# EAGLE design interface-board (EAGLE 6.4)
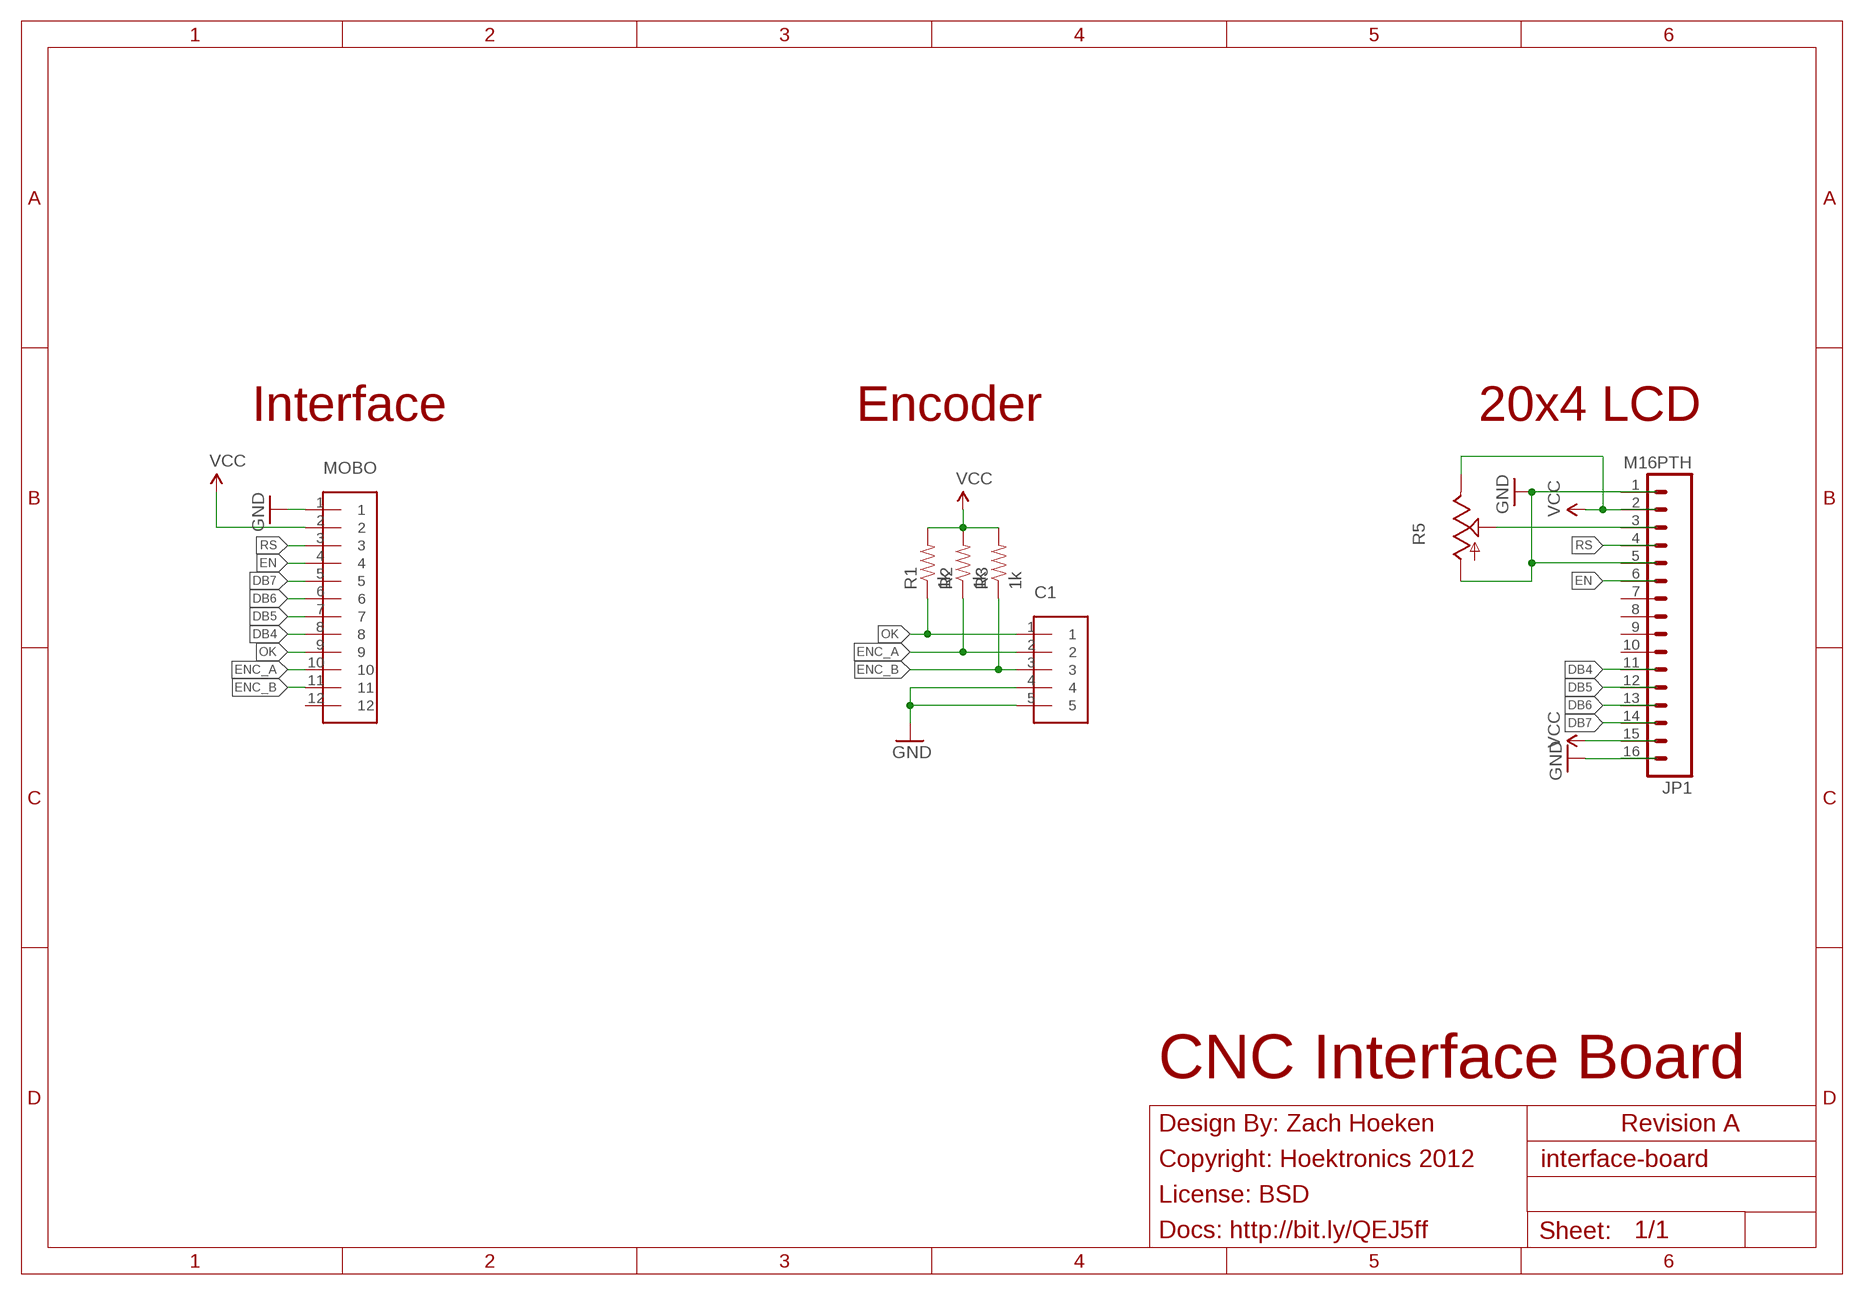
[diagram p0: schematic, sheet 1]

## Parts
C1  CONN-5  [XH-5]
JP1  M16PTH  [1X16]
MOBO  CONN-12  [XH-12]
R1  1k  RESISTOR0805  [0805-RC]
R2  1k  RESISTOR0805  [0805-RC]
R3  1k  RESISTOR0805  [0805-RC]
R5  TRIM_US-B25P  [B25P]

## Nets
DB4: JP1.11 MOBO.8
DB5: JP1.12 MOBO.7
DB6: JP1.13 MOBO.6
DB7: JP1.14 MOBO.5
EN: JP1.6 MOBO.4
ENC_A: C1.2 MOBO.10 R2.1
ENC_B: C1.3 MOBO.11 R3.1
GND: C1.4 C1.5 JP1.1 JP1.5 JP1.16 MOBO.1 R5.A
N$19: JP1.3 R5.S
OK: C1.1 MOBO.9 R1.1
RS: JP1.4 MOBO.3
VCC: JP1.2 JP1.15 MOBO.2 R1.2 R2.2 R3.2 R5.E
Unconnected: JP1.7 JP1.8 JP1.9 JP1.10 MOBO.12

## Notes on the sheet
- Interface | Encoder | 20x4 LCD
- CNC Interface Board
- Design By: Zach Hoeken | Revision A
- Copyright: Hoektronics 2012
- License: BSD
- Docs: http://bit.ly/QEJ5ff

## Library data of the parts
C1 = Hoektronics:CONN-5
JP1 = SparkFun-Connectors:M16: 1x16 .1" header
MOBO = Hoeken:CONN-12
R1-R3 = Hoektronics:RESISTOR: Resistor Basic schematic elements and footprints for 0603, 1206, and PTH 1/10th watt (small) resistors.
R5 = pot:TRIM_US-: POTENTIOMETER

## Net classes
0 default: width 0.381 mm, clearance 0.381 mm

## Board
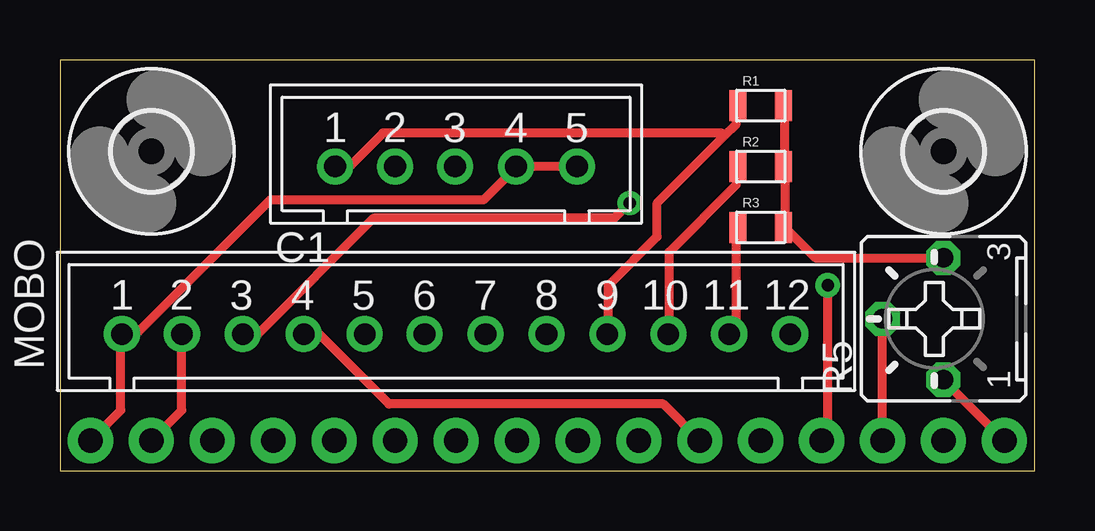
[diagram p1: board, top side]
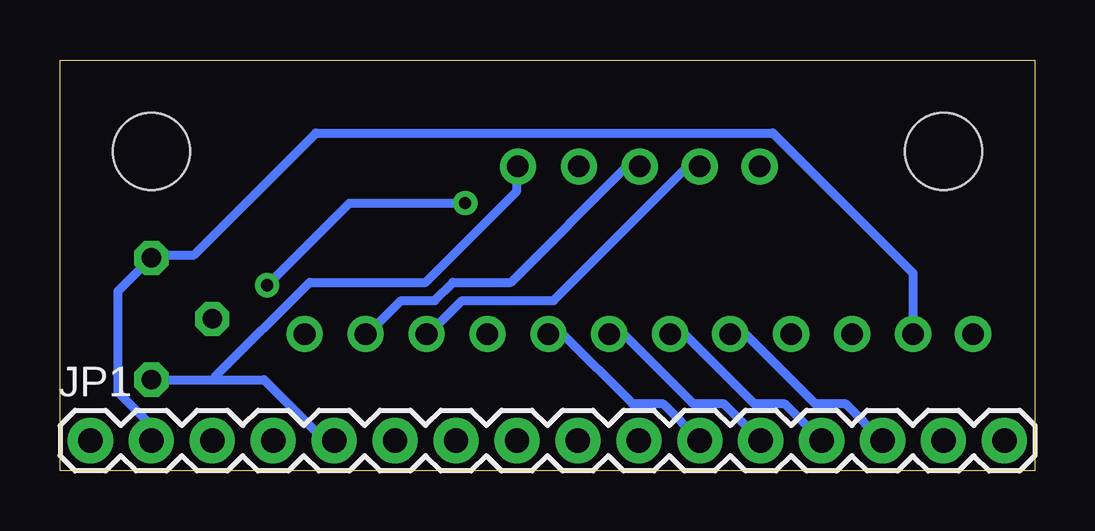
[diagram p2: board, bottom side, seen from below]

Size 40.64 x 17.14 mm. Coordinates in mm from the lower left corner, seen from the top.
Outline: 0,0 40.64,0 40.64,17.14 0,17.14 0,0
Copper layers (1*16): Top 0.035mm / dielectric 1.5mm / Bottom 0.035mm
Design rules "hoektronics": minimum track width 8mil, minimum drill 20mil, track to track 8mil, track to pad 8mil, pad to pad 8mil, via to via 8mil, smd to smd 8mil, copper to edge 10mil, drill to drill 8mil, minimum pad ring 12mil, minimum via ring 10mil, stop-mask expansion 4mil, vias tented up to drill 25mil, thermal gap 10mil

### Footprints (pad centres in the part's own frame; a part is rotated, then mirrored left to right if it is on the bottom)
XH-5 = drill 0.9: 1 -3.77,0; 2 -1.27,0; 3 1.23,0; 4 3.77,0; 5 6.31,0
1X16 = drill 1.016 pad 1.88: 1 0,0; 2 2.54,0; 3 5.08,0; 4 7.62,0; 5 10.16,0; 6 12.7,0; 7 15.24,0; 8 17.78,0; 9 20.32,0; 10 22.86,0; 11 25.4,0; 12 27.94,0; 13 30.48,0; 14 33.02,0; 15 35.56,0; 16 38.1,0
XH-12 = drill 0.9: 1 -6.31,0; 2 -3.81,0; 3 -1.27,0; 4 1.27,0; 5 3.81,0; 6 6.31,0; 7 8.85,0; 8 11.39,0; 9 13.93,0; 10 16.47,0; 11 19.01,0; 12 21.55,0
0805-RC = smd 0.7 x 1.3: 1 -0.95,0; 2 0.95,0
B25P = drill 0.813 octagon: A -2.54,0; E 2.54,0; S 0,2.54
3,2 = hole 3.2: 0,0

### Placement (x,y rotation side)
C1  15.24,12.7 0 top
JP1  39.37,1.27 0 bottom
MOBO  8.89,5.71 0 top
R1  29.21,15.24 0 top
R2  29.21,12.7 0 top
R3  29.21,10.16 0 top
R5  36.83,6.35 90 top
U$1  [3,2]  3.81,13.34 0 top
U$2  [3,2]  36.83,13.34 0 top

### Tracks (layer width: path | path; a pad name or v marks a point on that pad's centre or on a via)
DB4
  Bottom 0.381: MOBO.8 19.68,5.71 16.76,2.79 15.49,2.79 JP1.11
DB5
  Bottom 0.381: MOBO.7 17.14,5.71 14.22,2.79 12.95,2.79 JP1.12
DB6
  Bottom 0.381: MOBO.6 14.61,5.71 11.68,2.79 10.41,2.79 JP1.13
DB7
  Bottom 0.381: MOBO.5 12.06,5.71 9.14,2.79 7.87,2.79 JP1.14
EN
  Top 0.381: MOBO.4 10.79,5.71 13.72,2.79 25.15,2.79 JP1.6
ENC_A
  Top 0.381: R2.1 28.19,12.7 28.19,11.94 25.4,9.14 25.4,5.71 MOBO.10
  Bottom 0.381: C1.2 14.48,12.7 20.07,7.11 23.88,7.11 25.27,5.71 MOBO.10
ENC_B
  Top 0.381: R3.1 28.19,10.16 28.19,5.97 27.94,5.71 MOBO.11
  Bottom 0.381: C1.3 17.02,12.7 21.84,7.87 24.26,7.87 25.02,7.11 26.42,7.11 27.81,5.71 MOBO.11
GND
  Top 0.381: JP1.16 2.54,2.54 2.54,5.71 MOBO.1 2.67,5.84 3.3,5.84 8.76,11.3 17.65,11.3 18.92,12.57 C1.4 C1.5 | JP1.1 R5.A
  Bottom 0.381: JP1.5 29.59,1.27 32.13,3.81 34.16,3.81 | R5.A 34.16,3.81 | C1.5 21.59,12.7 21.59,11.68 25.4,7.87 30.23,7.87 34.16,3.94 34.16,3.81
N$19
  Top 0.381: JP1.3 R5.S
OK
  Top 0.381: 27.69,13.97 24.89,11.18 24.89,9.78 22.86,7.75 22.86,5.71 MOBO.9 | 27.69,13.97 28.19,14.48 28.19,15.24 R1.1 | C1.1 12.06,12.7 13.46,14.1 27.56,14.1 27.69,13.97
RS  (via drill 0.51)
  Top 0.381: MOBO.3 8.26,5.71 13.08,10.54 23.11,10.54 v23.75,11.18 | v32,7.75 32,1.52 JP1.4
  Bottom 0.381: v23.75,11.18 28.57,11.18 v32,7.75
VCC
  Top 0.381: MOBO.2 5.08,2.54 JP1.15 | R1.2 30.23,15.24 30.23,12.83 R2.2 30.23,12.7 30.23,10.16 R3.2 30.35,10.03 31.5,8.89 R5.E
  Bottom 0.381: JP1.2 36.83,1.91 38.23,3.3 38.23,7.49 R5.E 36.7,9.02 35.05,9.02 29.97,14.1 10.92,14.1 5.08,8.26 MOBO.2

### Text on the board
tPlace: CNC Interface Board | Revision: A | Copyright Hoektronics | License: GPLv3 | Design By: Hoeken | Docs: bit.ly/QEJ5ff